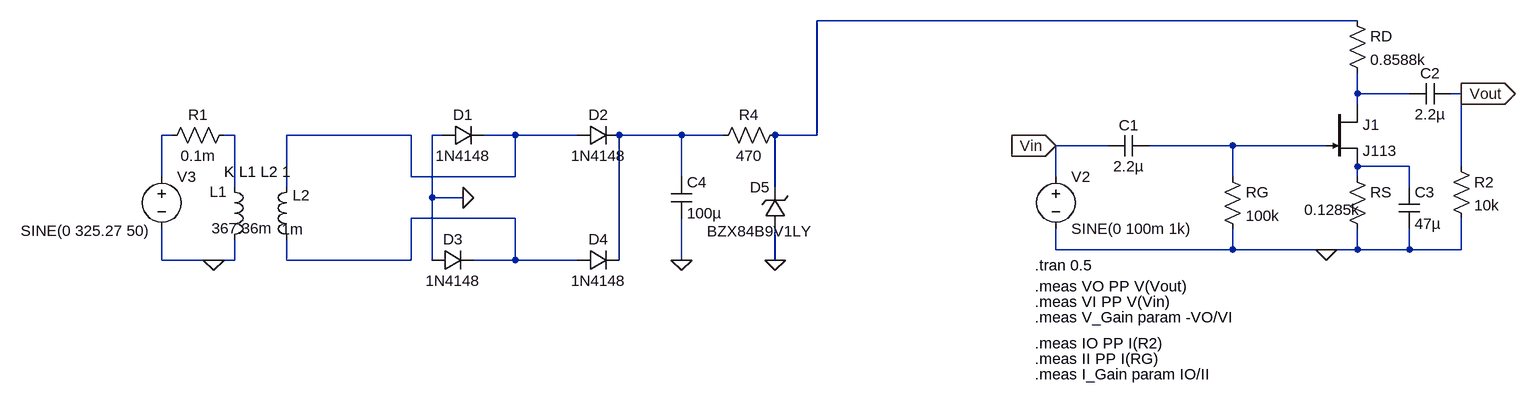
[diagram p0: schematic 230469B.asc]
230469B.asc, the LTspice schematic file:
Version 4.1
SHEET 1 880 680
WIRE 272 -352 -560 -352
WIRE 272 -240 272 -272
WIRE 352 -240 272 -240
WIRE 432 -240 416 -240
WIRE 272 -224 272 -240
WIRE -1552 -176 -1568 -176
WIRE -1456 -176 -1472 -176
WIRE -1184 -176 -1376 -176
WIRE -1136 -176 -1152 -176
WIRE -1024 -176 -1072 -176
WIRE -928 -176 -1024 -176
WIRE -768 -176 -864 -176
WIRE -704 -176 -768 -176
WIRE -560 -176 -560 -352
WIRE -560 -176 -624 -176
WIRE -112 -160 -192 -160
WIRE 80 -160 -48 -160
WIRE 224 -160 80 -160
WIRE 352 -128 272 -128
WIRE 432 -128 432 -240
WIRE -1568 -112 -1568 -176
WIRE -1184 -112 -1184 -176
WIRE -1024 -112 -1024 -176
WIRE -1024 -112 -1184 -112
WIRE -768 -112 -768 -176
WIRE -192 -112 -192 -160
WIRE 80 -112 80 -160
WIRE 272 -112 272 -128
WIRE -1456 -96 -1456 -176
WIRE -1376 -96 -1376 -176
WIRE -624 -96 -624 -176
WIRE 352 -96 352 -128
WIRE -1152 -80 -1152 -176
WIRE -1104 -80 -1152 -80
WIRE -1024 -48 -1184 -48
WIRE -192 0 -192 -32
WIRE 80 0 80 -32
WIRE 80 0 -192 0
WIRE 224 0 80 0
WIRE 272 0 272 -32
WIRE 272 0 224 0
WIRE 352 0 352 -32
WIRE 352 0 272 0
WIRE 432 0 432 -48
WIRE 432 0 352 0
WIRE -1568 16 -1568 -32
WIRE -1488 16 -1568 16
WIRE -1456 16 -1456 -16
WIRE -1456 16 -1488 16
WIRE -1376 16 -1376 -16
WIRE -1184 16 -1184 -48
WIRE -1184 16 -1376 16
WIRE -1152 16 -1152 -80
WIRE -1024 16 -1024 -48
WIRE -1024 16 -1088 16
WIRE -928 16 -1024 16
WIRE -864 16 -864 -176
WIRE -768 16 -768 -48
WIRE -624 16 -624 -32
FLAG 224 0 0
FLAG -192 -160 Vin
IOPIN -192 -160 In
FLAG 432 -240 Vout
IOPIN 432 -240 Out
FLAG -1488 16 0
FLAG -1104 -80 0
FLAG -624 16 0
FLAG -768 16 0
SYMBOL njf 224 -224 R0
SYMATTR InstName J1
SYMATTR Value J113
SYMBOL res 256 -368 R0
SYMATTR InstName RD
SYMATTR Value 0.8588k
SYMBOL voltage -192 -128 R0
WINDOW 123 0 0 Left 0
WINDOW 39 0 0 Left 0
SYMATTR InstName V2
SYMATTR Value SINE(0 100m 1k)
SYMBOL cap -48 -176 R90
WINDOW 0 0 32 VBottom 2
WINDOW 3 32 32 VTop 2
SYMATTR InstName C1
SYMATTR Value 2.2µ
SYMBOL cap 416 -256 R90
WINDOW 0 0 32 VBottom 2
WINDOW 3 32 32 VTop 2
SYMATTR InstName C2
SYMATTR Value 2.2µ
SYMBOL res 416 -144 R0
SYMATTR InstName R2
SYMATTR Value 10k
SYMBOL res 256 -128 R0
WINDOW 3 -66 67 Left 2
SYMATTR Value 0.1285k
SYMATTR InstName RS
SYMBOL res 64 -128 R0
SYMATTR InstName RG
SYMATTR Value 100k
SYMBOL cap 336 -96 R0
SYMATTR InstName C3
SYMATTR Value 47µ
SYMBOL ind -1472 -112 R0
WINDOW 0 -22 23 Left 2
WINDOW 3 -19 79 Left 2
SYMATTR InstName L1
SYMATTR Value 367.36m
SYMBOL ind -1360 0 R180
WINDOW 0 -20 84 Left 2
WINDOW 3 -10 31 Left 2
SYMATTR InstName L2
SYMATTR Value 1m
SYMBOL voltage -1568 -128 R0
WINDOW 3 -217 99 Left 2
WINDOW 123 0 0 Left 0
WINDOW 39 0 0 Left 0
SYMATTR Value SINE(0 325.27 50)
SYMATTR InstName V3
SYMBOL res -1456 -192 R90
WINDOW 0 0 56 VBottom 2
WINDOW 3 32 56 VTop 2
SYMATTR InstName R1
SYMATTR Value 0.1m
SYMBOL diode -1136 -160 R270
WINDOW 0 32 32 VTop 2
WINDOW 3 0 32 VBottom 2
SYMATTR InstName D1
SYMATTR Value 1N4148
SYMBOL diode -928 -160 R270
WINDOW 0 32 32 VTop 2
WINDOW 3 0 32 VBottom 2
SYMATTR InstName D2
SYMATTR Value 1N4148
SYMBOL diode -1152 32 R270
WINDOW 0 32 32 VTop 2
WINDOW 3 0 32 VBottom 2
SYMATTR InstName D3
SYMATTR Value 1N4148
SYMBOL diode -928 32 R270
WINDOW 0 32 32 VTop 2
WINDOW 3 0 32 VBottom 2
SYMATTR InstName D4
SYMATTR Value 1N4148
SYMBOL zener -608 -32 R180
WINDOW 0 24 64 Left 2
WINDOW 3 -40 -4 Left 2
SYMATTR InstName D5
SYMATTR Value BZX84B9V1LY
SYMBOL res -608 -192 R90
WINDOW 0 0 56 VBottom 2
WINDOW 3 32 56 VTop 2
SYMATTR InstName R4
SYMATTR Value 470
SYMBOL cap -784 -112 R0
SYMATTR InstName C4
SYMATTR Value 100µ
TEXT -224 24 Left 2 !.tran 0.5
TEXT -224 56 Left 2 !.meas VO PP V(Vout)
TEXT -224 80 Left 2 !.meas VI PP V(Vin)
TEXT -224 104 Left 2 !.meas V_Gain param -VO/VI
TEXT -224 144 Left 2 !.meas IO PP I(R2)
TEXT -224 168 Left 2 !.meas II PP I(RG)
TEXT -224 192 Left 2 !.meas I_Gain param IO/II
TEXT -1472 -120 Left 2 !K L1 L2 1

The netlist it stands for:
* 230469B.asc
J1 N002 N007 N008 J113
RD N001 N002 0.8588k
V2 Vin 0 SINE(0 100m 1k)
C1 N007 Vin 2.2µ
C2 Vout N002 2.2µ
R2 Vout 0 10k
RS N008 0 0.1285k
RG N007 0 100k
C3 N008 0 47µ
L1 N004 0 367.36m
L2 N009 N005 1m
V3 N003 0 SINE(0 325.27 50)
R1 N004 N003 0.1m
D1 0 N005 1N4148
D2 N005 N006 1N4148
D3 0 N009 1N4148
D4 N009 N006 1N4148
D5 0 N001 BZX84B9V1LY
R4 N001 N006 470
C4 N006 0 100µ
.model D D
.lib standard.dio
.model NJF NJF
.model PJF PJF
.lib standard.jft
.tran 0.5
.meas VO PP V(Vout)
.meas VI PP V(Vin)
.meas V_Gain param -VO/VI
.meas IO PP I(R2)
.meas II PP I(RG)
.meas I_Gain param IO/II
K L1 L2 1
.backanno
.end

* Results of the author's LTspice run, read from the files saved beside the schematic
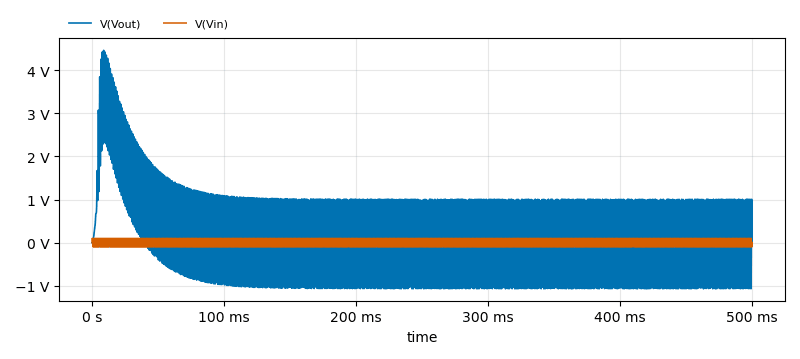
[diagram p1: Transient Analysis of 230469B.asc, plotted from the saved traces]
* Transient Analysis, 1 run:
*   V(Vout): min -1.07 V, max 4.464 V, average 210.2 mV, rms 978.1 mV, last -23.14 mV
*   V(Vin): min -100 mV, max 100 mV, average -18.33 µV, rms 71.26 mV, last 0 V
* From the log:
*   vo: PP(V(Vout))=5.53386668503 FROM 0 TO 0.5
*   vi: PP(V(Vin))=0.20000000298 FROM 0 TO 0.5
*   v_gain: -VO/VI=-27.6693330129
*   io: PP(I(R2))=0.000553386681304 FROM 0 TO 0.5
*   ii: PP(I(RG))=2.00075209378e-06 FROM 0 TO 0.5
*   i_gain: IO/II=276.589330095